# Altium schematic sheet usbttl.SchDoc
size A3
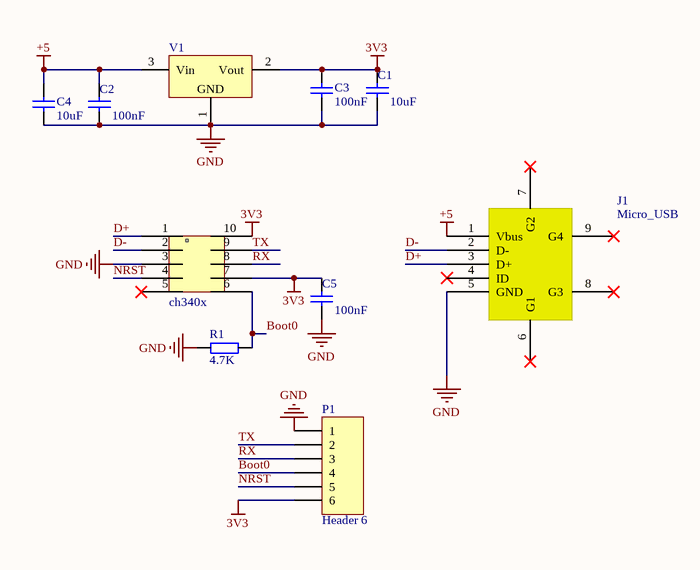
[diagram p0: usbttl.SchDoc]

## Parts
*1  ch340x  [MSOP-10_L3.0-W3.0-P0.50-LS5.0-BL]
C1  10uF  [C0603]
C2  100nF  [C0603]
C3  100nF  [C0603]
C4  10uF  [C0603]
C5  100nF  [C0603]
J1  Micro_USB  [MICRO-USB-SMD_MICROQTJ]
P1  Header 6  [HDR-TH_6P-P2.54-V-M-R2-C3-S2.54-1]
R1  4.7K  [0603P]
V1  AMS1117-3V3  [SOT223_L]  (value not drawn)

## Nets
3V3: *1.7(VCC) *1.10(V3) C1.2 C3.2 C5.2 P1.6 V1.2(Vout)
+5: C2.2 C4.2 J1.1(Vbus) V1.3(Vin)
GND: *1.3(GND) C1.1 C2.1 C3.1 C4.1 C5.1 J1.5(GND) P1.1 R1.1 V1.1(GND)
Boot0: *1.6(DTR#) P1.4 R1.2
D+: *1.1(UD+) J1.3(D+)
D-: *1.2(UD-) J1.2(D-)
NRST: *1.4(RTS#) P1.5
RX: *1.8(TXD) P1.3
TX: *1.9(RXD) P1.2

Not connected (* = marked no-connect by the designer): *1 5(CTS#)*; J1 4(ID)* 6(G1)* 7(G2)* 8(G3)* 9(G4)*

## Library data of the parts
C1-C5 = Cap: Capacitor; Published: 8-Jun-2000; LatestRevisionDate: 17-Jul-2002; LatestRevisionNote: Re-released for DXP Platform.; PackageReference: RAD-0.3; Publisher: Altium Limited; PackageDescription: Radial Cap, Thru-Hole; 2 Leads; 0.3 in Pin Spacing
  C1 C4: Value: 10uF
  C2 C3 C5: Value: 100nF
P1 = Header 6: Header, 6-Pin; LatestRevisionDate: 17-Jul-2002; LatestRevisionNote: Re-released for DXP Platform.; Publisher: Altium Limited
R1 = R
V1 = AMS1117: 三端稳压芯片; BOM名称: 稳压芯片; 版权归属: 源创客; 学习资源: www.ooocke.com